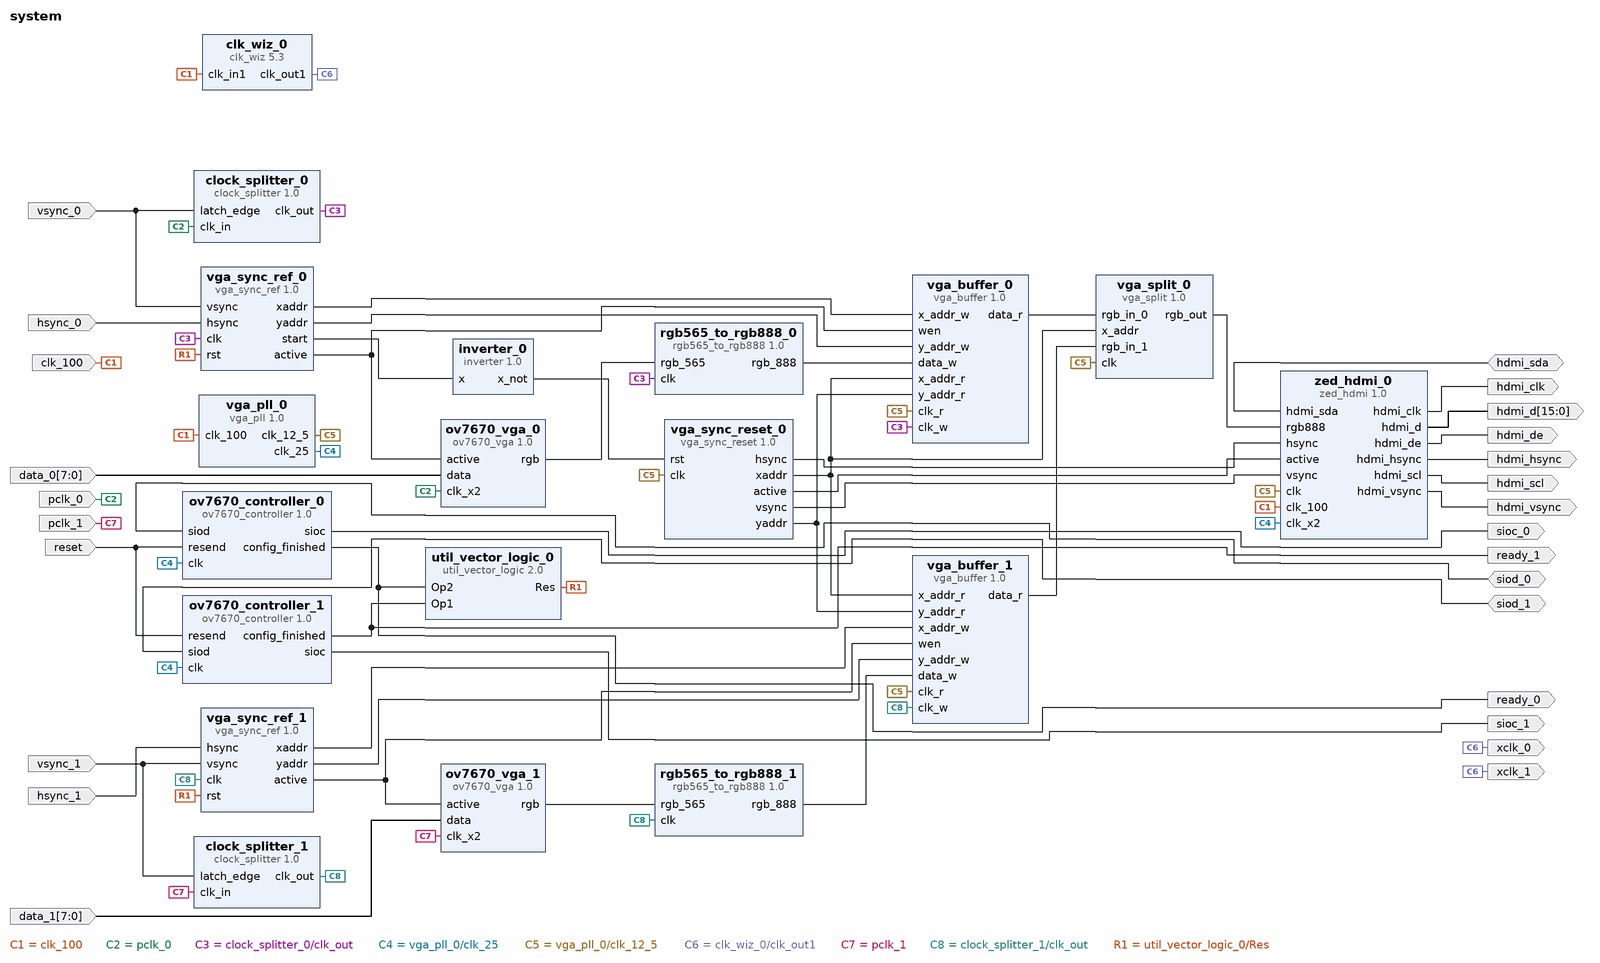
[diagram p0: block diagram of the top level]
# Vivado block design system, xc7z020clg484-1, Vivado 2016.4
create_bd_design system

create_bd_port -dir O -type clk hdmi_clk
create_bd_port -dir O hdmi_hsync
create_bd_port -dir O hdmi_vsync
create_bd_port -dir O -from 15 -to 0 hdmi_d
create_bd_port -dir O hdmi_de
create_bd_port -dir O hdmi_scl
create_bd_port -dir IO hdmi_sda
create_bd_port -dir I clk_100
create_bd_port -dir O sioc_0
create_bd_port -dir IO siod_0
create_bd_port -dir I -from 7 -to 0 data_0
create_bd_port -dir I reset
create_bd_port -dir I pclk_0
create_bd_port -dir I hsync_0
create_bd_port -dir I vsync_0
create_bd_port -dir O xclk_1
create_bd_port -dir O xclk_0
create_bd_port -dir I -from 7 -to 0 data_1
create_bd_port -dir I hsync_1
create_bd_port -dir I vsync_1
create_bd_port -dir I pclk_1
create_bd_port -dir O sioc_1
create_bd_port -dir IO siod_1
create_bd_port -dir O ready_1
create_bd_port -dir O ready_0

create_bd_cell -type ip -vlnv xilinx.com:user:ov7670_controller:1.0 ov7670_controller_0
create_bd_cell -type ip -vlnv xilinx.com:user:zed_hdmi:1.0 zed_hdmi_0
create_bd_cell -type ip -vlnv xilinx.com:user:rgb565_to_rgb888:1.0 rgb565_to_rgb888_0
create_bd_cell -type ip -vlnv xilinx.com:user:vga_buffer:1.0 vga_buffer_0
set_property -dict {CONFIG.SIZE_POW2 10} [get_bd_cells vga_buffer_0]
create_bd_cell -type ip -vlnv xilinx.com:user:vga_pll:1.0 vga_pll_0
create_bd_cell -type ip -vlnv xilinx.com:ip:clk_wiz:5.3 clk_wiz_0
set_property -dict [list \
  CONFIG.CLKOUT1_REQUESTED_OUT_FREQ 11.9 \
  CONFIG.USE_RESET false \
  CONFIG.MMCM_DIVCLK_DIVIDE 5 \
  CONFIG.MMCM_CLKFBOUT_MULT_F 44.625 \
  CONFIG.MMCM_CLKOUT0_DIVIDE_F 75.000 \
  CONFIG.CLKOUT1_JITTER 394.277 \
  CONFIG.CLKOUT1_PHASE_ERROR 301.475 \
] [get_bd_cells clk_wiz_0]
create_bd_cell -type ip -vlnv user.org:user:inverter:1.0 inverter_0
create_bd_cell -type ip -vlnv xilinx.com:user:vga_sync_reset:1.0 vga_sync_reset_0
create_bd_cell -type ip -vlnv xilinx.com:user:vga_sync_ref:1.0 vga_sync_ref_0
create_bd_cell -type ip -vlnv xilinx.com:user:vga_sync_ref:1.0 vga_sync_ref_1
create_bd_cell -type ip -vlnv xilinx.com:user:vga_buffer:1.0 vga_buffer_1
set_property -dict {CONFIG.SIZE_POW2 10} [get_bd_cells vga_buffer_1]
create_bd_cell -type ip -vlnv xilinx.com:user:rgb565_to_rgb888:1.0 rgb565_to_rgb888_1
create_bd_cell -type ip -vlnv xilinx.com:user:vga_split:1.0 vga_split_0
create_bd_cell -type ip -vlnv xilinx.com:user:ov7670_controller:1.0 ov7670_controller_1
create_bd_cell -type ip -vlnv xilinx.com:ip:util_vector_logic:2.0 util_vector_logic_0
set_property -dict {CONFIG.C_SIZE 1} [get_bd_cells util_vector_logic_0]
create_bd_cell -type ip -vlnv xilinx.com:user:clock_splitter:1.0 clock_splitter_0
create_bd_cell -type ip -vlnv xilinx.com:user:clock_splitter:1.0 clock_splitter_1
create_bd_cell -type ip -vlnv xilinx.com:user:ov7670_vga:1.0 ov7670_vga_0
create_bd_cell -type ip -vlnv xilinx.com:user:ov7670_vga:1.0 ov7670_vga_1

# ---- connections ----

connect_bd_net [get_bd_pins zed_hdmi_0/hdmi_clk] [get_bd_ports hdmi_clk]
connect_bd_net [get_bd_pins zed_hdmi_0/hdmi_hsync] [get_bd_ports hdmi_hsync]
connect_bd_net [get_bd_pins zed_hdmi_0/hdmi_vsync] [get_bd_ports hdmi_vsync]
connect_bd_net [get_bd_pins zed_hdmi_0/hdmi_d] [get_bd_ports hdmi_d]
connect_bd_net [get_bd_pins zed_hdmi_0/hdmi_de] [get_bd_ports hdmi_de]
connect_bd_net [get_bd_pins zed_hdmi_0/hdmi_scl] [get_bd_ports hdmi_scl]
connect_bd_net [get_bd_ports hdmi_sda] [get_bd_pins zed_hdmi_0/hdmi_sda]
connect_bd_net -net clk_100_1 [get_bd_ports clk_100] [get_bd_pins zed_hdmi_0/clk_100] [get_bd_pins vga_pll_0/clk_100] [get_bd_pins clk_wiz_0/clk_in1]
connect_bd_net [get_bd_pins ov7670_controller_0/sioc] [get_bd_ports sioc_0]
connect_bd_net [get_bd_ports siod_0] [get_bd_pins ov7670_controller_0/siod]
connect_bd_net [get_bd_ports data_0] [get_bd_pins ov7670_vga_0/data]
connect_bd_net -net resend_1 [get_bd_ports reset] [get_bd_pins ov7670_controller_0/resend] [get_bd_pins ov7670_controller_1/resend]
connect_bd_net [get_bd_pins ov7670_vga_0/rgb] [get_bd_pins rgb565_to_rgb888_0/rgb_565]
connect_bd_net [get_bd_ports pclk_0] [get_bd_pins clock_splitter_0/clk_in] [get_bd_pins ov7670_vga_0/clk_x2]
connect_bd_net [get_bd_pins clock_splitter_0/clk_out] \
  [get_bd_pins rgb565_to_rgb888_0/clk] [get_bd_pins vga_buffer_0/clk_w] [get_bd_pins vga_sync_ref_0/clk]
connect_bd_net [get_bd_ports hsync_0] [get_bd_pins vga_sync_ref_0/hsync]
connect_bd_net [get_bd_ports vsync_0] [get_bd_pins vga_sync_ref_0/vsync] [get_bd_pins clock_splitter_0/latch_edge]
connect_bd_net [get_bd_pins vga_sync_ref_0/active] [get_bd_pins vga_buffer_0/wen] [get_bd_pins ov7670_vga_0/active]
connect_bd_net [get_bd_pins vga_sync_reset_0/xaddr] \
  [get_bd_pins vga_buffer_0/x_addr_r] [get_bd_pins vga_buffer_1/x_addr_r] [get_bd_pins vga_split_0/x_addr]
connect_bd_net [get_bd_pins vga_sync_reset_0/yaddr] [get_bd_pins vga_buffer_0/y_addr_r] [get_bd_pins vga_buffer_1/y_addr_r]
connect_bd_net [get_bd_pins vga_pll_0/clk_25] \
  [get_bd_pins zed_hdmi_0/clk_x2] [get_bd_pins ov7670_controller_0/clk] [get_bd_pins ov7670_controller_1/clk]
connect_bd_net [get_bd_pins vga_pll_0/clk_12_5] \
  [get_bd_pins zed_hdmi_0/clk] [get_bd_pins vga_buffer_0/clk_r] [get_bd_pins vga_sync_reset_0/clk] \
  [get_bd_pins vga_buffer_1/clk_r] [get_bd_pins vga_split_0/clk]
connect_bd_net [get_bd_pins vga_sync_reset_0/hsync] [get_bd_pins zed_hdmi_0/hsync]
connect_bd_net [get_bd_pins vga_sync_reset_0/active] [get_bd_pins zed_hdmi_0/active]
connect_bd_net [get_bd_pins vga_sync_reset_0/vsync] [get_bd_pins zed_hdmi_0/vsync]
connect_bd_net [get_bd_pins clk_wiz_0/clk_out1] [get_bd_ports xclk_0] [get_bd_ports xclk_1]
connect_bd_net [get_bd_pins vga_sync_ref_0/xaddr] [get_bd_pins vga_buffer_0/x_addr_w]
connect_bd_net [get_bd_pins vga_sync_ref_0/yaddr] [get_bd_pins vga_buffer_0/y_addr_w]
connect_bd_net [get_bd_pins inverter_0/x_not] [get_bd_pins vga_sync_reset_0/rst]
connect_bd_net [get_bd_pins rgb565_to_rgb888_0/rgb_888] [get_bd_pins vga_buffer_0/data_w]
connect_bd_net -net data_1_1 [get_bd_ports data_1] [get_bd_pins ov7670_vga_1/data]
connect_bd_net -net hsync_1_1 [get_bd_ports hsync_1] [get_bd_pins vga_sync_ref_1/hsync]
connect_bd_net -net vsync_1_1 [get_bd_ports vsync_1] [get_bd_pins vga_sync_ref_1/vsync] [get_bd_pins clock_splitter_1/latch_edge]
connect_bd_net [get_bd_pins vga_sync_ref_1/active] [get_bd_pins vga_buffer_1/wen] [get_bd_pins ov7670_vga_1/active]
connect_bd_net [get_bd_pins vga_sync_ref_1/xaddr] [get_bd_pins vga_buffer_1/x_addr_w]
connect_bd_net [get_bd_pins vga_sync_ref_1/yaddr] [get_bd_pins vga_buffer_1/y_addr_w]
connect_bd_net [get_bd_pins ov7670_vga_1/rgb] [get_bd_pins rgb565_to_rgb888_1/rgb_565]
connect_bd_net [get_bd_pins rgb565_to_rgb888_1/rgb_888] [get_bd_pins vga_buffer_1/data_w]
connect_bd_net -net pclk_1_1 [get_bd_ports pclk_1] [get_bd_pins clock_splitter_1/clk_in] [get_bd_pins ov7670_vga_1/clk_x2]
connect_bd_net [get_bd_pins clock_splitter_1/clk_out] \
  [get_bd_pins vga_sync_ref_1/clk] [get_bd_pins rgb565_to_rgb888_1/clk] [get_bd_pins vga_buffer_1/clk_w]
connect_bd_net [get_bd_pins vga_sync_ref_0/start] [get_bd_pins inverter_0/x]
connect_bd_net [get_bd_pins vga_buffer_1/data_r] [get_bd_pins vga_split_0/rgb_in_1]
connect_bd_net [get_bd_pins vga_buffer_0/data_r] [get_bd_pins vga_split_0/rgb_in_0]
connect_bd_net [get_bd_pins vga_split_0/rgb_out] [get_bd_pins zed_hdmi_0/rgb888]
connect_bd_net [get_bd_pins ov7670_controller_1/sioc] [get_bd_ports sioc_1]
connect_bd_net [get_bd_ports siod_1] [get_bd_pins ov7670_controller_1/siod]
connect_bd_net [get_bd_pins ov7670_controller_1/config_finished] [get_bd_ports ready_1] [get_bd_pins util_vector_logic_0/Op1]
connect_bd_net [get_bd_pins ov7670_controller_0/config_finished] [get_bd_ports ready_0] [get_bd_pins util_vector_logic_0/Op2]
connect_bd_net [get_bd_pins util_vector_logic_0/Res] [get_bd_pins vga_sync_ref_0/rst] [get_bd_pins vga_sync_ref_1/rst]

validate_bd_design
save_bd_design
